# Altium project TX_custom.PrjPcb
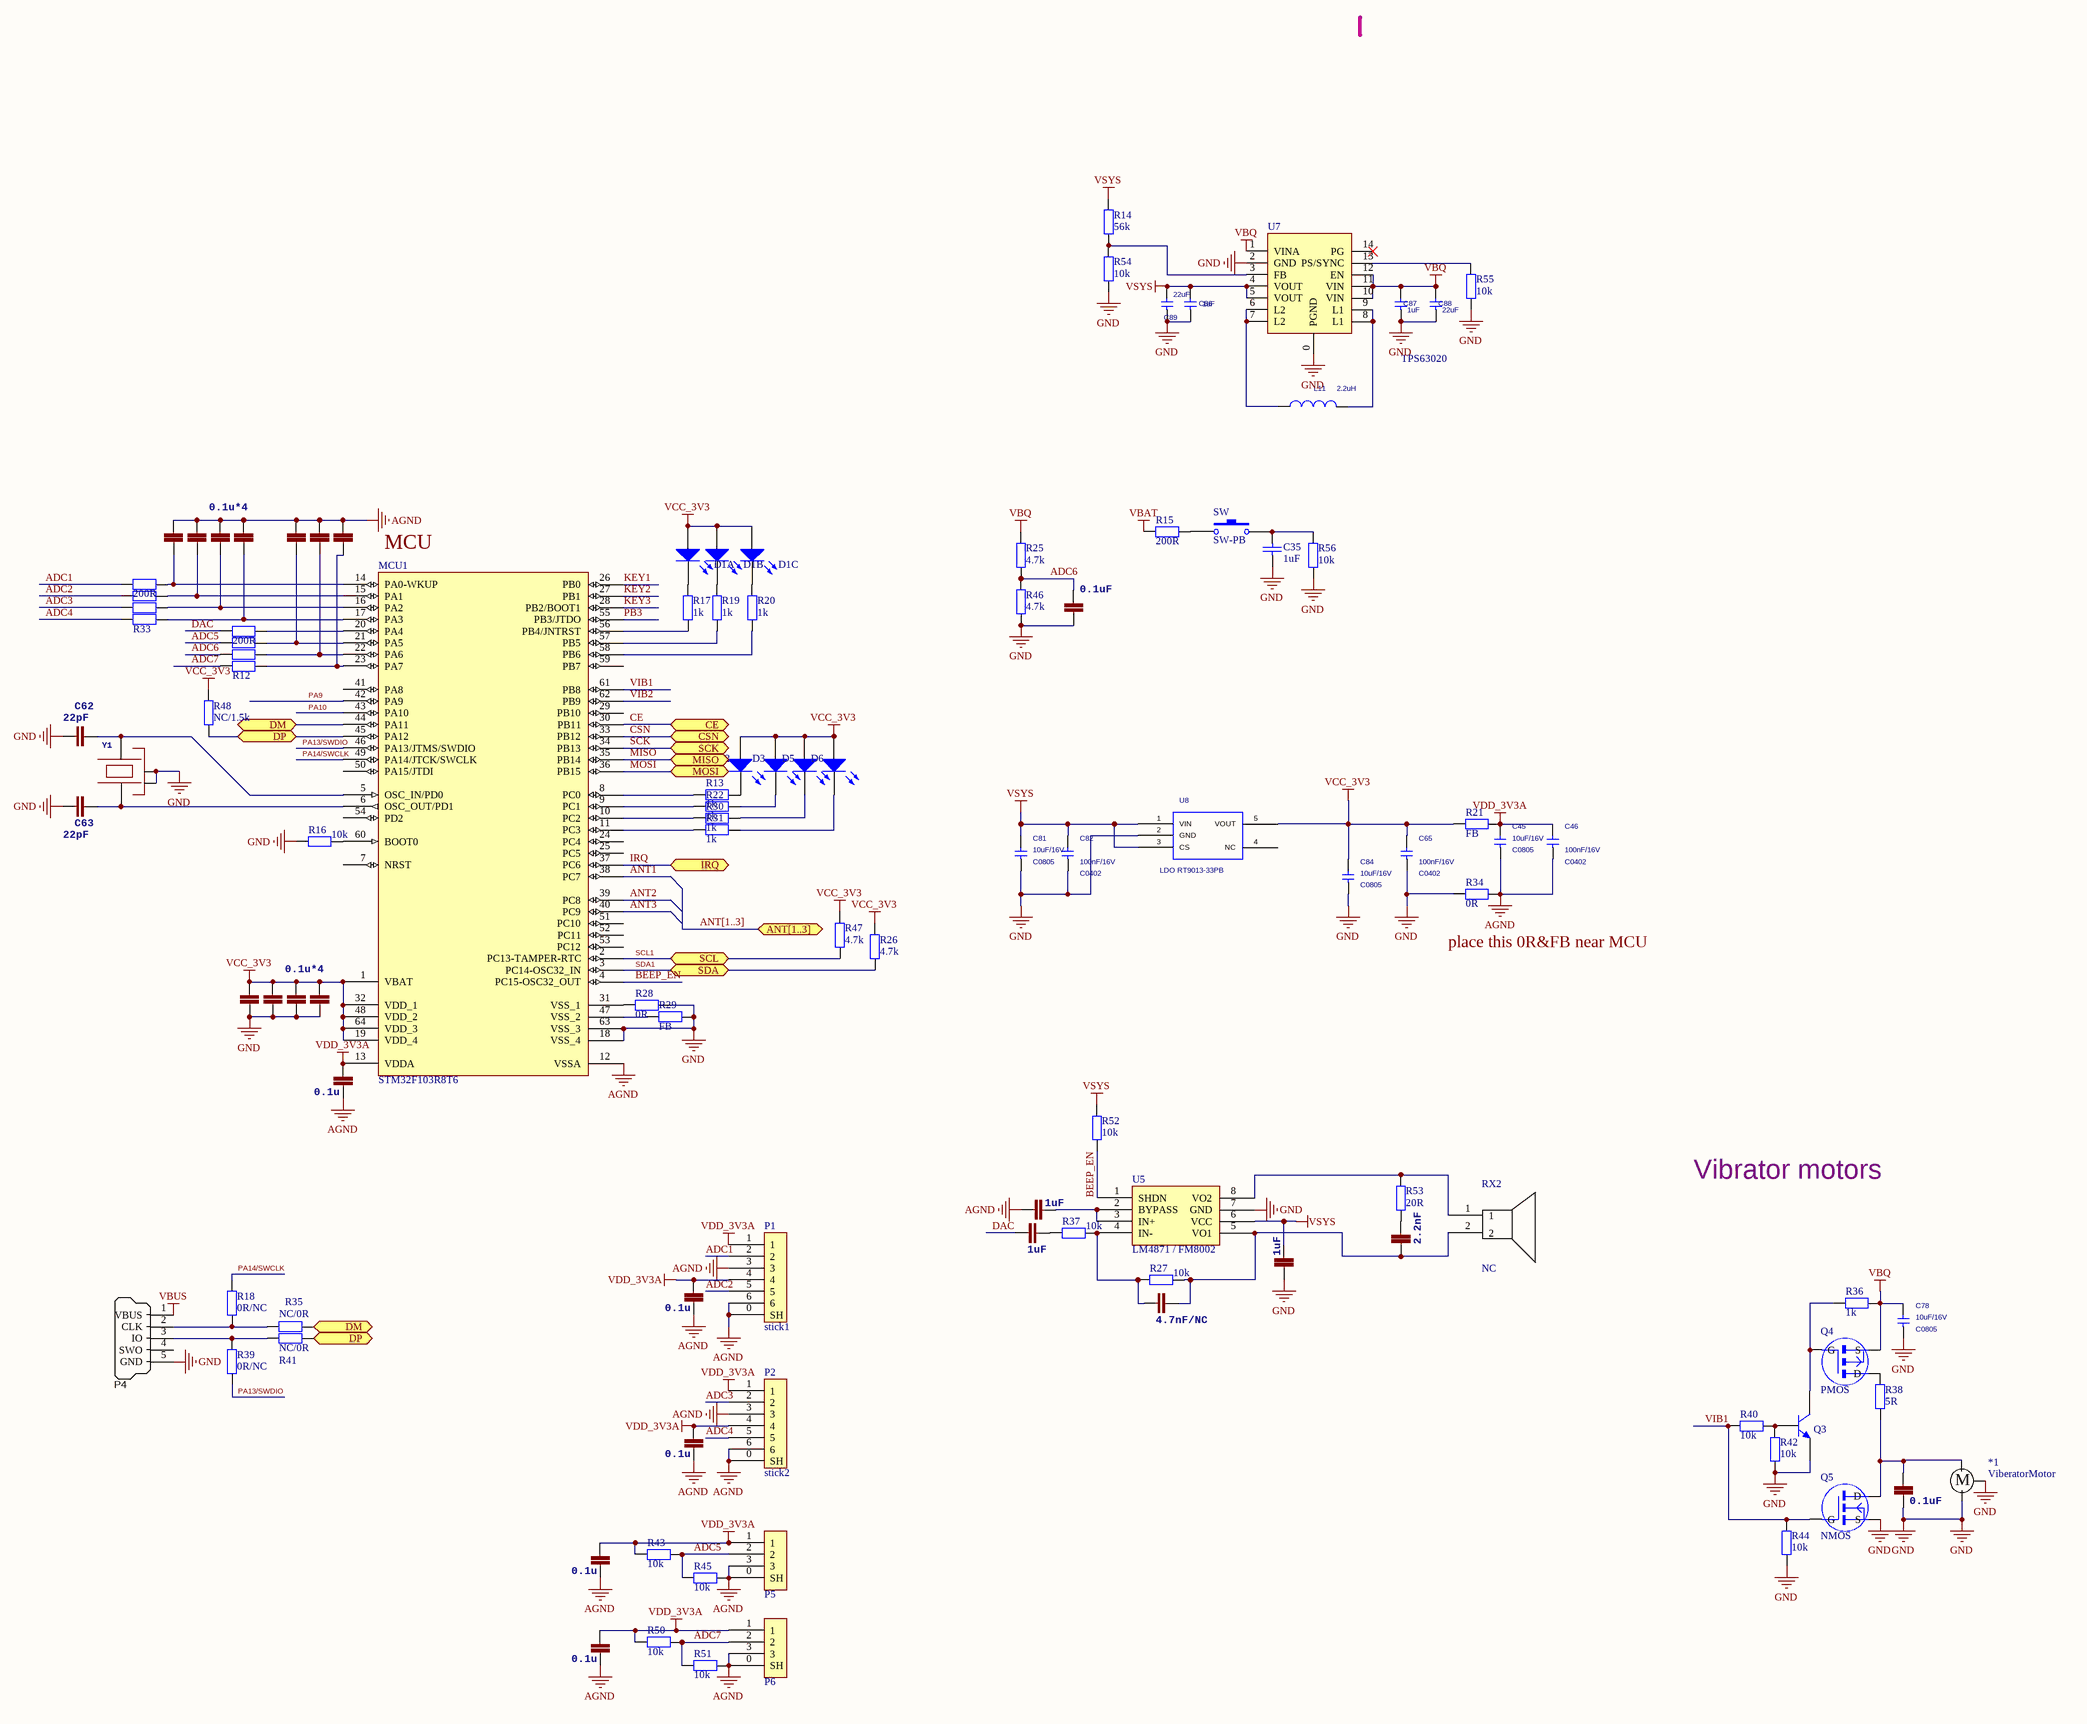
[diagram p0: TX_custom.SchDoc]
4 sheets, 202 parts. Net scope: flat (ports and power ports of the same name join across sheets).
Board file: TX_custom.PcbDoc
Sheets:
  TX_custom.SchDoc
  FEM.SchDoc
  BK5811.SchDoc
  BQ24295.SchDoc

## Sheet TX_custom.SchDoc
size A2

### Parts
*1  ViberatorMotor  [VibratorMotor]
C35  1uF  [0402]
C37  0.1uF  [0603]
C45  value 10uF/16V  PCB DECAL: C0805  [0805]  (hidden comment: C)
C46  value 100nF/16V  PCB DECAL: C0402  [0603]  (hidden comment: C)
C54  0.1u*4  [0402]
C55  1n  [0402]  (value not drawn)
C56  1n  [0402]  (value not drawn)
C57  1n  [0402]  (value not drawn)
C58  1n  [0402]  (value not drawn)
C59  1n  [0402]  (value not drawn)
C60  1n  [0402]  (value not drawn)
C61  0.1uF  [0402]
C62  22pF  [0402]
C63  22pF  [0402]
C65  value 100nF/16V  PCB DECAL: C0402  [0603]  (hidden comment: C)
C67  0.1u*4  [0402]
C68  1n  [0402]  (value not drawn)
C69  1n  [0402]  (value not drawn)
C70  1n  [0402]  (value not drawn)
C71  0.1u  [0402]
C72  1uF  [0603]
C73  1uF  [0603]
C74  2.2nF  [0402]
C75  1uF  [0603]
C76  4.7nF/NC  [0402]
C77  0.1u  [0402]
C78  value 10uF/16V  PCB DECAL: C0805  [0805]  (hidden comment: C)
C79  0.1u  [0402]
C80  0.1u  [0402]
C81  value 10uF/16V  PCB DECAL: C0805  [0805]  (hidden comment: C)
C82  value 100nF/16V  PCB DECAL: C0402  [0603]  (hidden comment: C)
C83  0.1u  [0402]
C84  value 10uF/16V  PCB DECAL: C0805  [0805]  (hidden comment: C)
C86  1uF  [0805]
C87  1uF  [0805]
C88  22uF  [0805]
C89  22uF  [0805]
D1  LEDx3  [LC-0603_Rx2]  (value not drawn)  (parts A,B,C of 3)
D2  LED0  [0603LED]  (value not drawn)
D3  LED0  [0603LED]  (value not drawn)
D5  LED0  [0603LED]  (value not drawn)
D6  LED0  [0603LED]  (value not drawn)
L11  2.2uH  [L3015]
MCU1  STM32F103R8T6  [LQFP64_N]
P1  stick1  [WFRSM125 - 6P]
P2  stick2  [WFRSM125 - 6P]
P4  SWD_MicroUSB  [MICRO-YZX]  (value not drawn)
P5  3PSocket_T  [WFRSM125 - 3P]  (value not drawn)
P6  3PSocket_T  [WFRSM125 - 3P]  (value not drawn)
Q3  NPN  [SOT-23B_L]  (value not drawn)
Q4  PMOS  [SOT-23B_L]
Q5  NMOS  [SOT-23B_L]
R12  200R  [0402X4]
R13  1k  [0402]
R14  56k  [0402]
R15  200R  [0402]
R16  10k  [0402]
R17  1k  [0402]
R18  0R/NC  [0402]
R19  1k  [0402]
R20  1k  [0402]
R21  FB  [0402]
R22  1k  [0402]
R25  4.7k  [0402]
R26  4.7k  [0402]
R27  10k  [0402]
R28  0R  [0402]
R29  FB  [0402]
R30  1k  [0402]
R31  1k  [0402]
R33  200R  [0402X4]
R34  0R  [0402]
R35  NC/0R  [0402]
R36  1k  [0402]
R37  10k  [0402]
R38  5R  [0603]
R39  0R/NC  [0402]
R40  10k  [0402]
R41  NC/0R  [0402]
R42  10k  [0402]
R43  10k  [0402]
R44  10k  [0402]
R45  10k  [0402]
R46  4.7k  [0402]
R47  4.7k  [0402]
R48  NC/1.5k  [0402]
R50  10k  [0402]
R51  10k  [0402]
R52  10k  [0402]
R53  20R  [0402]
R54  10k  [0402]
R55  10k  [0402]
R56  10k  [0402]
RX2  NC  [sonar-10mm]
SW  SW-PB  [SW3x4]
U5  LM4871 / FM8002  [SOIC8_39MM]
U7  TPS63020  [TPS63020]
U8  value LDO RT9013-33PB  [SOT23-5]  (hidden comment: RT9193-33_1_2)
Y1  16Mhz  [OSCILLATOR-3.2X2.5]  (value not drawn)

### Ports
ANT[1..3], CE, CSN, DM, DP, IRQ, MISO, MOSI, SCK, SCL, SDA

### Nets
AGND: C45.2 C46.2 C54.2 C55.2 C56.2 C57.2 C58.2 C59.2 C60.2 C71.1 C72.2 C77.1 C79.1 C80.1 C83.1 MCU1.12(VSSA) P1.0(SH) P1.3 P1.6 P2.0(SH) P2.3 P2.6 P5.0(SH) P5.3 P6.0(SH) P6.3 R34.1 R45.2 R51.2
GND: *1.0 *1.2 C35.2 C37.2 C61.1 C62.2 C63.2 C65.2 C67.1 C68.1 C69.1 C70.1 C75.2 C78.2 C81.2 C82.2 C84.2 C86.2 C87.2 C88.2 C89.2 MCU1.18(VSS_4) MCU1.63(VSS_3) P4.5(GND) Q3.2(E) Q5.S R16.1 R28.1 R29.1 R34.2 R42.1 R44.1 R46.1 R54.2 R55.2 R56.1 U5.7(GND) U7.0(PGND) U7.2(GND) U8.2(GND) Y1.2(NC_2) Y1.4(NC_4)
VBAT: R15.1
VBQ: C78.1 C87.1 C88.1 Q4.S R25.2 R36.1 U7.1(VINA) U7.10(VIN) U7.11(VIN) U7.12(EN)
VBUS: P4.1(VBUS)
VCC_3V3: C65.1 C67.2 C68.2 C69.2 C70.2 C84.1 D1.1(A) D2.1(A) D3.1(A) D5.1(A) D6.1(A) MCU1.1(VBAT) MCU1.19(VDD_4) MCU1.32(VDD_1) MCU1.48(VDD_2) MCU1.64(VDD_3) R21.2 R26.2 R47.2 R48.2 U8.5(VOUT)
VDD_3V3A: C45.1 C46.1 C71.2 C77.2 C79.2 C80.2 C83.2 MCU1.13(VDDA) P1.1 P1.4 P2.1 P2.4 P5.1 P6.1 R21.1 R43.1 R50.1
VSYS: C75.1 C81.1 C82.1 C86.1 C89.1 R14.1 R52.2 U5.6(VCC) U7.4(VOUT) U7.5(VOUT) U8.1(VIN) U8.3(CS)
ADC1: P1.2 R33.1
ADC2: P1.5 R33.2
ADC3: P2.2 R33.3
ADC4: P2.5 R33.4
ADC5: P5.2 R12.2 R43.2 R45.1
ADC6: C61.2 R12.3 R25.1 R46.2
ADC7: P6.2 R12.4 R50.2 R51.1
ANT1: MCU1.38(PC7)
ANT2: MCU1.39(PC8)
ANT3: MCU1.40(PC9)
BEEP_EN: MCU1.4(PC15-OSC32_OUT) R52.1 U5.1(SHDN)
CE: MCU1.30(PB11) ; port CE
CSN: MCU1.33(PB12) ; port CSN
DAC: C73.2 R12.1
IRQ: MCU1.37(PC6) ; port IRQ
KEY1: MCU1.26(PB0)
KEY2: MCU1.27(PB1)
KEY3: MCU1.28(PB2/BOOT1)
MISO: MCU1.35(PB14) ; port MISO
MOSI: MCU1.36(PB15) ; port MOSI
PA9: MCU1.42(PA9)
PA10: MCU1.43(PA10)
PA13/SWDIO: MCU1.46(PA13/JTMS/SWDIO) R39.2
PA14/SWCLK: MCU1.49(PA14/JTCK/SWCLK) R18.1
PB3: MCU1.55(PB3/JTDO)
SCK: MCU1.34(PB13) ; port SCK
SCL1: MCU1.2(PC13-TAMPER-RTC) R47.1 ; port SCL
SDA1: MCU1.3(PC14-OSC32_IN) R26.1 ; port SDA
VIB1: MCU1.61(PB8) Q5.G R40.2 R44.2
VIB2: MCU1.62(PB9)
Net*1_1: *1.1 C37.1 Q5.D R38.1
NetC35_1: C35.1 R56.2 SW.2
NetC54_1: C54.1 MCU1.14(PA0-WKUP) R33.8
NetC55_1: C55.1 MCU1.15(PA1) R33.7
NetC56_1: C56.1 MCU1.16(PA2) R33.6
NetC57_1: C57.1 MCU1.17(PA3) R33.5
NetC58_1: C58.1 MCU1.21(PA5) R12.7
NetC59_1: C59.1 MCU1.22(PA6) R12.6
NetC60_1: C60.1 MCU1.23(PA7) R12.5
NetC62_1: C62.1 MCU1.5(OSC_IN/PD0) Y1.3
NetC63_1: C63.1 MCU1.6(OSC_OUT/PD1) Y1.1
NetC72_1: C72.1 U5.2(BYPASS) U5.3(IN+)
NetC73_1: C73.1 R37.1
NetC74_1: C74.1 R53.1
NetC74_2: C74.2 C76.1 R27.2 RX2.2 U5.5(VO1)
NetC76_2: C76.2 R27.1 R37.2 U5.4(IN-)
NetD1_2: D1.2(K) R17.2
NetD1_3: D1.3(K) R19.2
NetD1_4: D1.4(K) R20.2
NetD2_2: D2.2(K) R13.1
NetD3_2: D3.2(K) R22.1
NetD5_2: D5.2(K) R30.1
NetD6_2: D6.2(K) R31.1
NetL11_1: L11.1 U7.8(L1) U7.9(L1)
NetL11_2: L11.2 U7.6(L2) U7.7(L2)
NetMCU1_8: MCU1.8(PC0) R13.2
NetMCU1_9: MCU1.9(PC1) R22.2
NetMCU1_10: MCU1.10(PC2) R30.2
NetMCU1_11: MCU1.11(PC3) R31.2
NetMCU1_20: MCU1.20(PA4) R12.8
NetMCU1_31: MCU1.31(VSS_1) R28.2
NetMCU1_44: MCU1.44(PA11) R35.1 ; port DM
NetMCU1_45: MCU1.45(PA12) R41.1 R48.1 ; port DP
NetMCU1_47: MCU1.47(VSS_2) R29.2
NetMCU1_56: MCU1.56(PB4/JNTRST) R17.1
NetMCU1_57: MCU1.57(PB5) R19.1
NetMCU1_58: MCU1.58(PB6) R20.1
NetMCU1_60: MCU1.60(BOOT0) R16.2
NetP4_2: P4.2(CLK) R18.2 R35.2
NetP4_3: P4.3(IO) R39.1 R41.2
NetQ3_1: Q3.1(B) R40.1 R42.2
NetQ3_3: Q3.3(C) Q4.G R36.2
NetQ4_D: Q4.D R38.2
NetR14_2: R14.2 R54.1 U7.3(FB)
NetR15_2: R15.2 SW.1
NetR53_2: R53.2 RX2.1 U5.8(VO2)
NetR55_1: R55.1 U7.13(PS/SYNC)

Not connected (* = marked no-connect by the designer): MCU1 7(NRST) 24(PC4) 25(PC5) 29(PB10) 41(PA8) 50(PA15/JTDI) 51(PC10) 52(PC11) 53(PC12) 54(PD2) 59(PB7); P4 4(SWO); U7 14(PG)*; U8 4(NC)

### Buses and harness runs
bus ANT[1..3] = port ANT[1..3]

### Notes on the sheet
- MCU
- (near R34) place this 0R&FB near MCU
- Vibrator motors
- (in symbol ViberatorMotor) M

### Library data of the parts
C35 = Cap: Capacitor; Published: 8-Jun-2000; LatestRevisionDate: 17-Jul-2002; LatestRevisionNote: Re-released for DXP Platform.; PackageReference: RAD-0.3; Publisher: Altium Limited; PackageDescription: Radial Cap, Thru-Hole; 2 Leads; 0.3 in Pin Spacing
C37 C54-C63 C67-C77 C79 C80 C83 = CAP0402-CAP: <b>Capacitor</b> / Standard 0603 ceramic capacitor, and 0.1" leaded capacitor.; PARTNO: CC0402ZRY5V7BB104
C45 C46 C65 C78 C81 C82 C84 = C: Source_Path: C:\USERS\EULER-SJ\DESKTOP\CHEN-PI2\LIBRARY1.OLB; PSpiceTemplate: C^@REFDES %1 %2 ?TOLERANCE|C^@REFDES| @VALUE ?IC/IC=@IC/ ?TOLERANCE|\n.model C^@REFDES CAP C=1 DEV=@TOLERANCE%|
C86-C89 = C: PCB DECAL: C0805; Source_Path: C:\USERS\EULER-SJ\DESKTOP\CHEN-PI2\LIBRARY1.OLB; Value: 10uF/16V; PSpiceTemplate: C^@REFDES %1 %2 ?TOLERANCE|C^@REFDES| @VALUE ?IC/IC=@IC/ ?TOLERANCE|\n.model C^@REFDES CAP C=1 DEV=@TOLERANCE%|
D1 = LEDx3: Typical RED GaAs LED; Published: 8-Jun-2000; LatestRevisionDate: 08-Jul-2005; LatestRevisionNote: Mech Layer 1 removed.; PackageReference: LED-1; Publisher: Altium Limited; PackageDescription: LED; 2 Leads
D2 D3 D5 D6 = LED0: Typical INFRARED GaAs LED; Published: 8-Jun-2000; LatestRevisionDate: 08-Jul-2005; LatestRevisionNote: Mech Layer 1 removed.; PackageReference: LED-0; Publisher: Altium Limited; PackageDescription: LED; 2 Leads
L11 = INDUCTOR: PCB DECAL: LC7066CN; Source_Path: C:\PROGRAM FILES\ORCAD\CAPTURE\LIBRARY\DISCRETE.OLB; Value: 4.7uH
MCU1 = STM32F103R8T6: STM32 ARM-based 32-bit MCU with 64 Kbytes Flash, 64-pin LQFP, Industrial Temperature; Published: *; DatasheetVersion: *; PackageVersion: *; PackageReference: *; Publisher: *; PackageDescription: *; ComponentLink1Description: *; ComponentLink1URL: *; ComponentLink2Description: *; ComponentLink2URL: *
P1 P2 = 6PSocket_T
P4 = SWD_MicroUSB: Connector SMD USB Micro Type B middle mount; Manufacturer 1: Molex Inc; SCDType: undef; Package / Case: SMD; Supplier 1: Digi-Key; Supplier Part Number 1: WM17142CT-ND
Q3 = NPN: NPN Bipolar Transistor; Published: 8-Jun-2000; LatestRevisionDate: 29-May-2009; LatestRevisionNote: IPC-7351 Footprint Added.; PackageVersion: Aug-1999; PackageReference: SOT-23B; Publisher: Altium Limited; PackageDescription: 3-Pin SOT-23 Package 0.95 mm Pitch, 2.4 mm Lead Span
Q4 = PMOS: pin to pad: D>3 G>1 S>2
Q5 = NMOS: pin to pad: D>3 G>1 S>2
R12 R33 = Res*4: Resistor; Value: 0Ohm; Published: 8-Jun-2000; LatestRevisionDate: 17-Jul-2002; LatestRevisionNote: Re-released for DXP Platform.; PackageReference: AXIAL-0.4; Publisher: Altium Limited; PackageDescription: Axial Device, Thru-Hole; 2 Leads; 0.4 in Pin Spacing
R13 R16-R20 R22 R27 R30 R31 R35 R37 R39 R41 R43 R45 R50-R53 = Res2: Resistor; Value: 0Ohm; Published: 8-Jun-2000; LatestRevisionDate: 17-Jul-2002; LatestRevisionNote: Re-released for DXP Platform.; PackageReference: AXIAL-0.4; Publisher: Altium Limited; PackageDescription: Axial Device, Thru-Hole; 2 Leads; 0.4 in Pin Spacing
R14 R15 R21 R28 R29 R34 R36 R40 R44 R54-R56 = Res2: Resistor; Published: 8-Jun-2000; LatestRevisionDate: 17-Jul-2002; LatestRevisionNote: Re-released for DXP Platform.; PackageReference: AXIAL-0.4; Publisher: Altium Limited; PackageDescription: Axial Device, Thru-Hole; 2 Leads; 0.4 in Pin Spacing
R25 R26 R38 R42 R46-R48 = Res2: Resistor; Value: 22k 1%; Published: 8-Jun-2000; LatestRevisionDate: 17-Jul-2002; LatestRevisionNote: Re-released for DXP Platform.; PackageReference: AXIAL-0.4; Publisher: Altium Limited; PackageDescription: Axial Device, Thru-Hole; 2 Leads; 0.4 in Pin Spacing
RX2 = sonar
SW = SW-PB: Switch; Published: 24-Mar-1999; LatestRevisionDate: 17-Jul-2002; LatestRevisionNote: Re-released for DXP Platform.; PackageReference: SPST-2; Publisher: Altium Limited; PackageDescription: Switch; 2 Leads
U5 = LM4871
U8 = RT9193-33_1_2: Part_No_: 1; Source_Path: W:\PROJECT\JOVI\NT96650\REFERENCE CIRCUIT\NT96650ES_PANA34110.DSN; PCB DECAL: SOT23-5
Y1 = OSCILLATOR-3.2X2.5: Crystal Oscillator in 3.2x2.5 SMD

## Sheet FEM.SchDoc
size A4
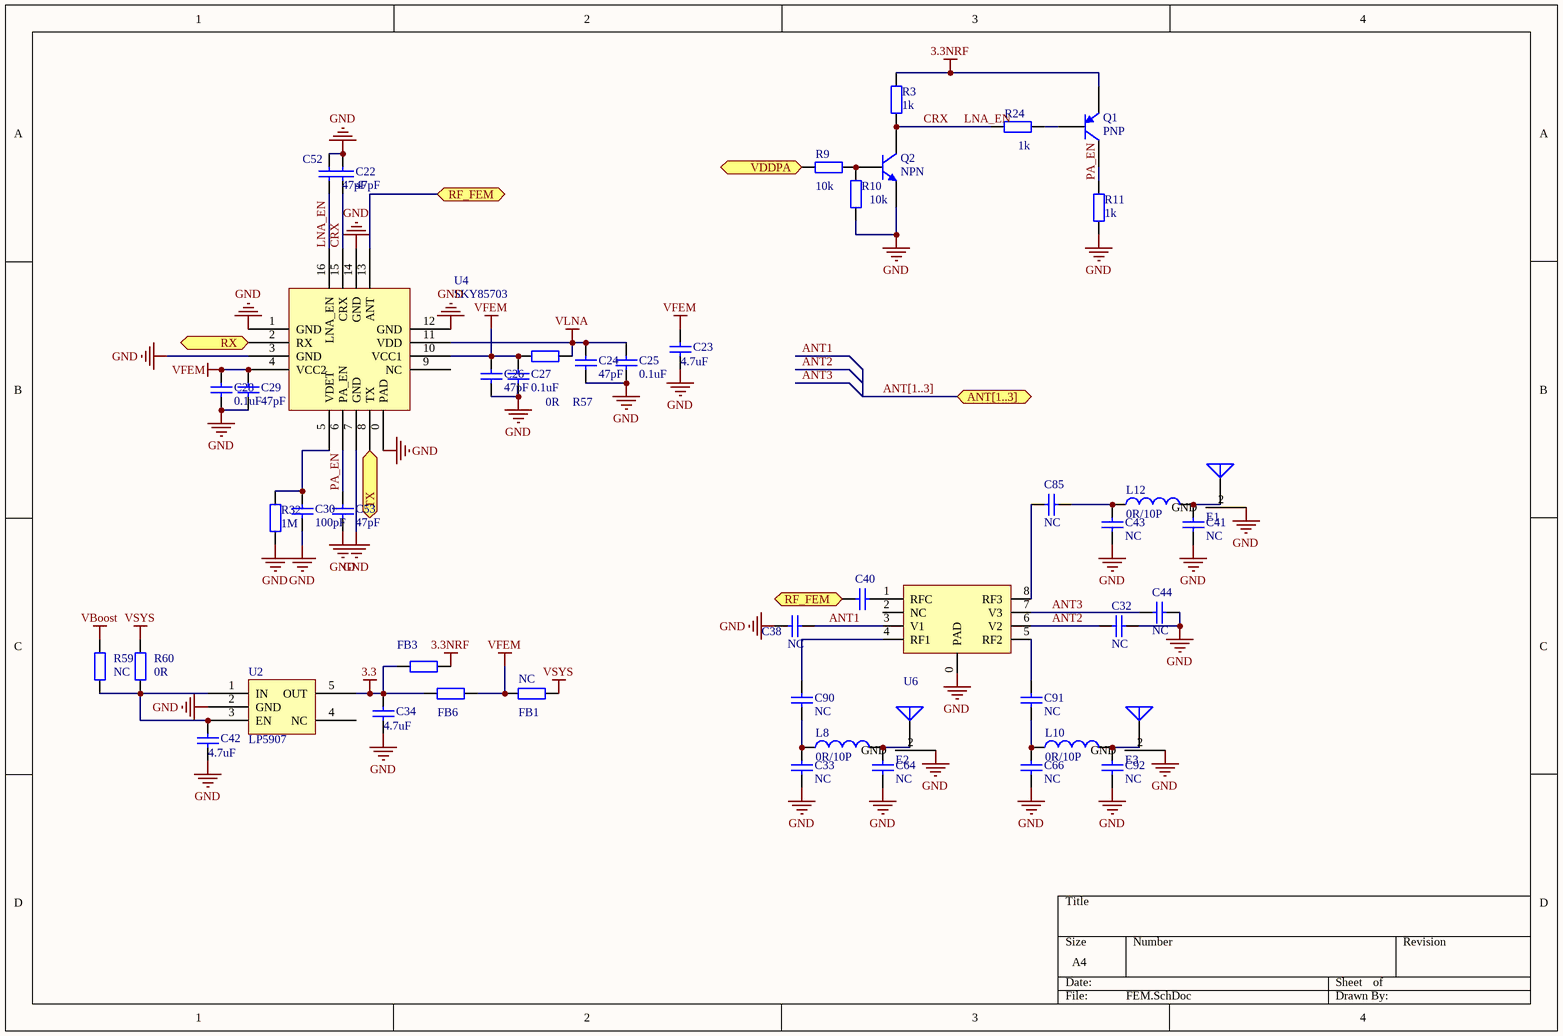
[diagram p1: FEM.SchDoc]

### Parts
C22  47pF  [0402]
C23  4.7uF  [0805]
C24  47pF  [0402]
C25  0.1uF  [0402]
C26  47pF  [0402]
C27  0.1uF  [0402]
C28  0.1uF  [0402]
C29  47pF  [0402]
C30  100pF  [0402]
C32  value NC  [0402]  (hidden comment: Cap)
C33  value NC  [0402]  (hidden comment: Cap)
C34  4.7uF  [0603]
C38  value NC  [0402]  (hidden comment: Cap)
C40  10p  [0402]  (value not drawn)
C41  value NC  [0402]  (hidden comment: Cap)
C42  4.7uF  [0603]
C43  value NC  [0402]  (hidden comment: Cap)
C44  value NC  [0402]  (hidden comment: Cap)
C52  47pF  [0402]
C53  47pF  [0402]
C64  value NC  [0402]  (hidden comment: Cap)
C66  value NC  [0402]  (hidden comment: Cap)
C85  value NC  [0402]  (hidden comment: Cap)
C90  value NC  [0402]  (hidden comment: Cap)
C91  value NC  [0402]  (hidden comment: Cap)
C92  value NC  [0402]  (hidden comment: Cap)
E1  Antenna  [IPEX]  (value not drawn)
E2  Antenna  [IPEX]  (value not drawn)
E3  Antenna  [IPEX]  (value not drawn)
FB1  NC  [0402]
FB3  Res2  [0402]  (value not drawn)
FB6  Res2  [0402]  (value not drawn)
L8  value 0R/10P  [0402]  (hidden comment: Inductor)
L10  value 0R/10P  [0402]  (hidden comment: Inductor)
L12  value 0R/10P  [0402]  (hidden comment: Inductor)
Q1  PNP  [LC-SOT-323(SC-70)]
Q2  NPN  [LC-SOT-323(SC-70)]
R3  value 1k  [0402]  (hidden comment: Res2)
R9  10k  [0402]
R10  10k  [0402]
R11  value 1k  [0402]  (hidden comment: Res2)
R24  value 1k  [0402]  (hidden comment: Res2)
R32  value 1M  [0402]  (hidden comment: Res2)
R57  0R  [0402]
R59  NC  [0402]
R60  0R  [0402]
U2  LP5907  [SOT23-5]
U4  SKY85703  [QFN16-3x3]
U6  SKY13417  [SKY13317]  (value not drawn)

### Ports
ANT[1..3], RF_FEM, RX, TX, VDDPA

### Nets
3.3: C34.2 FB3.1 FB6.1 U2.5(OUT)
3.3NRF: FB3.2 Q1.2(E) R3.1
GND: C22.1 C23.1 C24.1 C25.1 C26.1 C27.1 C28.1 C29.1 C30.1 C32.1 C33.2 C34.1 C38.1 C41.2 C42.1 C43.2 C44.1 C52.2 C53.1 C64.2 C66.2 C92.2 E1.2(GND) E2.2(GND) E3.2(GND) Q2.2(E) R10.1 R11.1 R32.2 U2.2(GND) U4.0(PAD) U4.1(GND) U4.3(GND) U4.7(GND) U4.12(GND) U4.14(GND) U6.0(PAD)
VBoost: R59.2
VFEM: C23.2 C26.2 C27.2 C28.2 C29.2 FB1.1 FB6.2 R57.1 U4.4(VCC2) U4.10(VCC1)
VLNA: C24.2 C25.2 R57.2 U4.11(VDD)
VSYS: FB1.2 R60.2
ANT1: C38.2 U6.3(V1)
ANT2: C32.2 U6.6(V2)
ANT3: C44.2 U6.7(V3)
CRX: C22.2 C52.1 Q2.3(C) R3.2 R24.1 U4.15(CRX) U4.16(LNA_EN)  [also labelled LNA_EN]
PA_EN: C53.2 Q1.3(C) R11.2 U4.6(PA_EN)
NetC7_2: U4.2(RX) ; port RX
NetC18_1: R9.1 ; port VDDPA
NetC30_2: C30.2 R32.1 U4.5(VDET)
NetC33_1: C33.1 C90.2 L8.1
NetC40_1: C40.1 U6.1(RFC)
NetC40_2: C40.2 U4.13(ANT) ; port RF_FEM
NetC41_1: C41.1 E1.1(ANT) L12.2
NetC42_2: C42.2 R59.1 R60.1 U2.1(IN) U2.3(EN)
NetC43_1: C43.1 C85.2 L12.1
NetC50_2: U4.8(TX) ; port TX
NetC64_1: C64.1 E2.1(ANT) L8.2
NetC66_1: C66.1 C91.2 L10.1
NetC85_1: C85.1 U6.8(RF3)
NetC90_1: C90.1 U6.4(RF1)
NetC91_1: C91.1 U6.5(RF2)
NetC92_1: C92.1 E3.1(ANT) L10.2
NetQ1_1: Q1.1(B) R24.2
NetQ2_1: Q2.1(B) R9.2 R10.2

Not connected (* = marked no-connect by the designer): U2 4(NC); U4 9(NC); U6 2(NC)

### Buses and harness runs
bus ANT[1..3] = port ANT[1..3]

### Library data of the parts
C22-C30 C32-C34 C38 C41-C44 C52 C53 C64 C66 C85 C90-C92 = Cap: Capacitor; Published: 8-Jun-2000; LatestRevisionDate: 17-Jul-2002; LatestRevisionNote: Re-released for DXP Platform.; PackageReference: RAD-0.3; Publisher: Altium Limited; PackageDescription: Radial Cap, Thru-Hole; 2 Leads; 0.3 in Pin Spacing
C40 = Cap: Capacitor; Value: NC; Published: 8-Jun-2000; LatestRevisionDate: 17-Jul-2002; LatestRevisionNote: Re-released for DXP Platform.; PackageReference: RAD-0.3; Publisher: Altium Limited; PackageDescription: Radial Cap, Thru-Hole; 2 Leads; 0.3 in Pin Spacing
E1-E3 = Antenna: Generic Antenna; Published: 24-Mar-1999; LatestRevisionDate: 17-Jul-2002; LatestRevisionNote: Re-released for DXP Platform.; PackageReference: PIN1; Publisher: Altium Limited
FB1 FB3 FB6 R59 R60 = Res2: Resistor; Value: FB; Published: 8-Jun-2000; LatestRevisionDate: 17-Jul-2002; LatestRevisionNote: Re-released for DXP Platform.; PackageReference: AXIAL-0.4; Publisher: Altium Limited; PackageDescription: Axial Device, Thru-Hole; 2 Leads; 0.4 in Pin Spacing
L8 L10 L12 = Inductor: Code_IEC: 1005; Published: 8-Jun-2000; LatestRevisionDate: 29-May-2009; LatestRevisionNote: IPC-7351 Footprint Added.; PackageReference: 0402-A; Publisher: Altium Limited; PackageDescription: Chip Inductor; Code_JEITA: 0402
Q1 = PNP: PNP Bipolar Transistor; Published: 8-Jun-2000; LatestRevisionDate: 29-May-2009; LatestRevisionNote: IPC-7351 Footprint Added.; PackageVersion: Aug-1999; PackageReference: SOT-23B; Publisher: Altium Limited; PackageDescription: 3-Pin SOT-23 Package 0.95 mm Pitch, 2.4 mm Lead Span
Q2 = NPN: NPN Bipolar Transistor; Published: 8-Jun-2000; LatestRevisionDate: 17-Jul-2002; LatestRevisionNote: Re-released for DXP Platform.; PackageReference: TO-226-AA; Publisher: Altium Limited; PackageDescription: TO, Flat Index; 3 In-Line, Axial Leads; Body Dia. 4.8mm; Leads 0.55 x 0.51 mm (max); Code_JEDEC: TO-226-AA
R3 R9-R11 R24 R32 R57 = Res2: Resistor; Published: 8-Jun-2000; LatestRevisionDate: 17-Jul-2002; LatestRevisionNote: Re-released for DXP Platform.; PackageReference: AXIAL-0.4; Publisher: Altium Limited; PackageDescription: Axial Device, Thru-Hole; 2 Leads; 0.4 in Pin Spacing

## Sheet BK5811.SchDoc
size A4
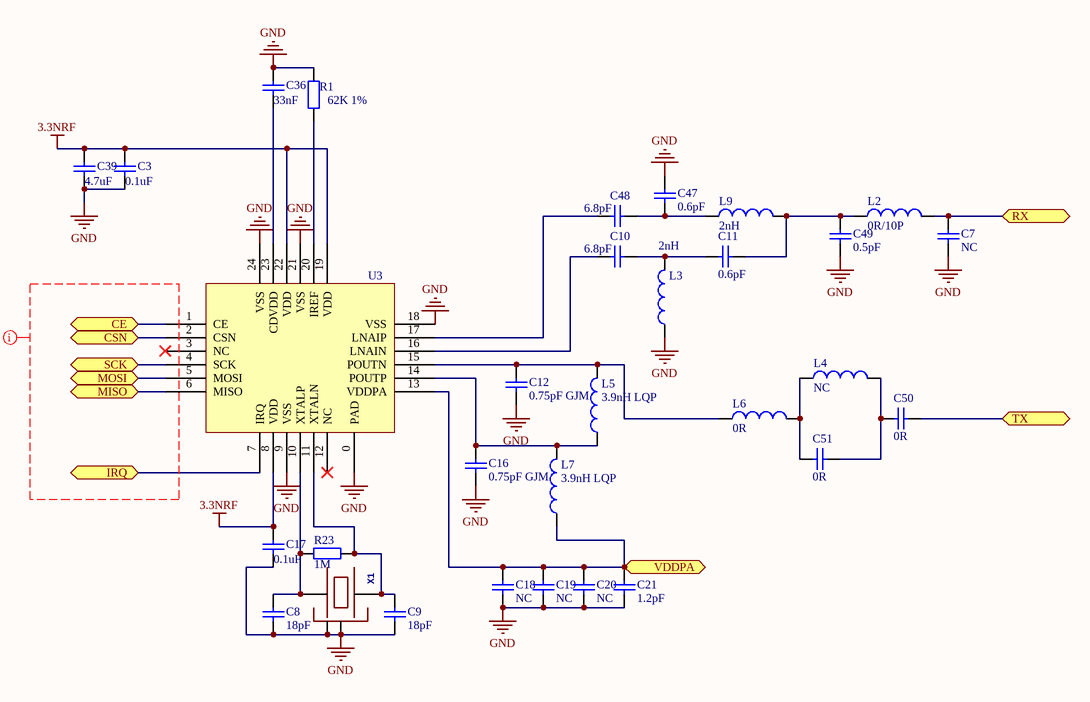
[diagram p2: BK5811.SchDoc]

### Parts
C3  0.1uF  [0402]
C7  NC  [0402]
C8  value 18pF  [0402]  (hidden comment: Cap)
C9  value 18pF  [0402]  (hidden comment: Cap)
C10  6.8pF  [0402]
C11  0.6pF  [0402]
C12  0.75pF GJM  [0402]
C16  0.75pF GJM  [0402]
C17  0.1uF  [0402]
C18  NC  [0402]
C19  NC  [0402]
C20  NC  [0402]
C21  1.2pF  [0402]
C36  33nF  [0402]
C39  4.7uF  [0603]
C47  0.6pF  [0402]
C48  6.8pF  [0402]
C49  0.5pF  [0402]
C50  0R  [0402]
C51  0R  [0402]
L2  0R/10P  [0402]
L3  2nH  [0402]
L4  NC  [0402]
L5  3.9nH LQP  [0402]
L6  0R  [0402]
L7  3.9nH LQP  [0402]
L9  2nH  [0402]
R1  62K 1%  [0402]
R23  value 1M  [0402]  (hidden comment: Res2)
U3  BK5811  [BK5811]  (value not drawn)
X1  16Mhz  [OSCILLATOR-3.2X2.5]  (value not drawn)

### Ports
CE, CSN, IRQ, MISO, MOSI, RX, SCK, TX, VDDPA

### Nets
3.3NRF: C3.2 C17.2 C39.2 U3.8(VDD) U3.19(VDD) U3.22(VDD)
GND: C3.1 C7.1 C8.2 C9.2 C12.1 C16.1 C17.1 C18.2 C19.2 C20.2 C21.2 C36.2 C39.1 C47.2 C49.1 L3.1 R1.2 U3.0(PAD) U3.9(VSS) U3.18(VSS) U3.21(VSS) U3.24(VSS) X1.2(NC_2) X1.4(NC_4)
CE: U3.1(CE) ; port CE
CSN: U3.2(CSN) ; port CSN
IRQ: U3.7(IRQ) ; port IRQ
MISO: U3.6(MISO) ; port MISO
MOSI: U3.5(MOSI) ; port MOSI
SCK: U3.4(SCK) ; port SCK
NetC7_2: C7.2 L2.2 ; port RX
NetC8_1: C8.1 R23.2 U3.10(XTALP) X1.1
NetC9_1: C9.1 R23.1 U3.11(XTALN) X1.3
NetC10_1: C10.1 U3.16(LNAIN)
NetC10_2: C10.2 C11.2 L3.2
NetC11_1: C11.1 C49.2 L2.1 L9.2
NetC12_2: C12.2 L5.2 L6.1 U3.15(POUTN)
NetC16_2: C16.2 L5.1 L7.2 U3.14(POUTP)
NetC18_1: C18.1 C19.1 C20.1 C21.1 L7.1 U3.13(VDDPA) ; port VDDPA
NetC36_1: C36.1 U3.23(CDVDD)
NetC47_1: C47.1 C48.2 L9.1
NetC48_1: C48.1 U3.17(LNAIP)
NetC50_1: C50.1 C51.2 L4.2
NetC50_2: C50.2 ; port TX
NetC51_1: C51.1 L4.1 L6.2
NetR1_1: R1.1 U3.20(IREF)

Not connected (* = marked no-connect by the designer): U3 3(NC)* 12(NC)*

### Layout directives
net class BK5811_SPI: (no net found under the mark)

### Library data of the parts
C3 C7-C12 C16-C21 C36 C39 C47-C51 = Cap: Capacitor; Published: 8-Jun-2000; LatestRevisionDate: 17-Jul-2002; LatestRevisionNote: Re-released for DXP Platform.; PackageReference: RAD-0.3; Publisher: Altium Limited; PackageDescription: Radial Cap, Thru-Hole; 2 Leads; 0.3 in Pin Spacing
L2-L7 L9 = Inductor: Code_IEC: 1005; Published: 8-Jun-2000; LatestRevisionDate: 29-May-2009; LatestRevisionNote: IPC-7351 Footprint Added.; PackageReference: 0402-A; Publisher: Altium Limited; PackageDescription: Chip Inductor; Code_JEITA: 0402
R1 R23 = Res2: Resistor; Published: 8-Jun-2000; LatestRevisionDate: 17-Jul-2002; LatestRevisionNote: Re-released for DXP Platform.; PackageReference: AXIAL-0.4; Publisher: Altium Limited; PackageDescription: Axial Device, Thru-Hole; 2 Leads; 0.4 in Pin Spacing
X1 = OSCILLATOR-3.2X2.5: Crystal Oscillator in 3.2x2.5 SMD

## Sheet BQ24295.SchDoc
size A4
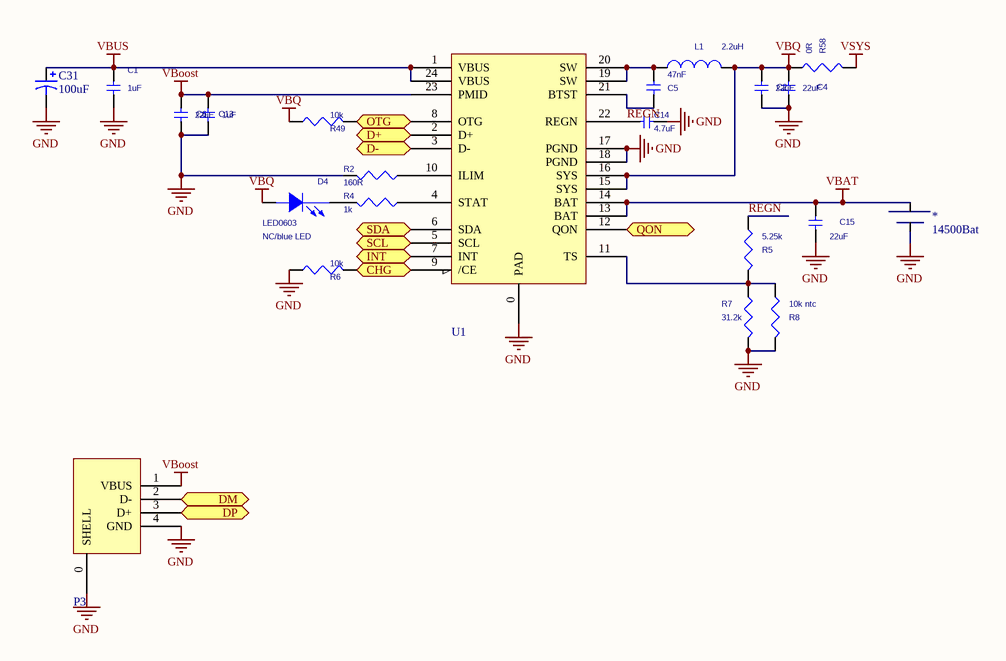
[diagram p3: BQ24295.SchDoc]

### Parts
*  14500Bat  [14500]
C1  1uF  [0805]
C2  22uF  [0805]
C4  22uF  [0805]
C5  47nF  [0402]
C6  22uF  [0805]
C13  1uF  [0603]
C14  4.7uF  [0603]
C15  22uF  [0805]
C31  100uF  [1210]
D4  value NC/blue LED  [LED0603]  (hidden comment: LED)
L1  2.2uH  [L50xx]
P3  USB_TYPE_A_SOCKET  [USB_TYPE_A_SOCKET]  (value not drawn)
R2  160R  [0402]
R4  1k  [0402]
R5  5.25k  [0402]
R6  10k  [0402]
R7  31.2k  [0402]
R8  10k ntc  [0603]
R49  10k  [0402]
R58  0R  [0402]
U1  BQ24295  [BQ24295]  (value not drawn)

### Ports
CHG, D+, D-, DM, DP, INT, OTG, QON, SCL, SDA

### Nets
GND: *.2 C1.2 C2.2 C4.2 C6.2 C13.2 C14.2 C15.2 C31.2 P3.0(SHELL) P3.4(GND) R2.2 R6.1 R7.2 R8.2 U1.0(PAD) U1.17(PGND) U1.18(PGND)
VBAT: *.1 C15.1 U1.13(BAT) U1.14(BAT)
VBoost: C6.1 C13.1 P3.1(VBUS) U1.23(PMID)
VBQ: C2.1 C4.1 D4.1(ANODE) L1.1 R49.1 R58.1 U1.15(SYS) U1.16(SYS)
VBUS: C1.1 C31.1 U1.1(VBUS) U1.24(VBUS)
VSYS: R58.2
REGN: C14.1 R5.1 U1.22(REGN)
SCL1: U1.5(SCL) ; port SCL
SDA1: U1.6(SDA) ; port SDA
NetC5_1: C5.1 U1.21(BTST)
NetC5_2: C5.2 L1.2 U1.19(SW) U1.20(SW)
NetD4_2: D4.2(CATHODE) R4.2
NetMCU1_44: P3.2(D-) ; port DM
NetMCU1_45: P3.3(D+) ; port DP
NetR2_1: R2.1 U1.10(ILIM)
NetR4_1: R4.1 U1.4(STAT)
NetR5_2: R5.2 R7.1 R8.1 U1.11(TS)
NetR6_2: R6.2 U1.9(/CE) ; port CHG
NetR49_2: R49.2 U1.8(OTG) ; port OTG
NetU1_2: U1.2(D+) ; port D+
NetU1_3: U1.3(D-) ; port D-
NetU1_7: U1.7(INT) ; port INT
NetU1_12: U1.12(QON) ; port QON

### Library data of the parts
C1 C5 C14 = C: PCB DECAL: C0402; Source_Path: C:\USERS\EULER-SJ\DESKTOP\CHEN-PI2\LIBRARY1.OLB; Value: 100nF/16V; PSpiceTemplate: C^@REFDES %1 %2 ?TOLERANCE|C^@REFDES| @VALUE ?IC/IC=@IC/ ?TOLERANCE|\n.model C^@REFDES CAP C=1 DEV=@TOLERANCE%|
C2 C4 C6 C13 C15 = C: as C86 on sheet TX_custom
C31 = Cap Pol1: Polarized Capacitor (Radial); Published: 8-Jun-2000; LatestRevisionDate: 17-Jul-2002; LatestRevisionNote: Re-released for DXP Platform.; PackageReference: RB7.6-15; Publisher: Altium Limited; PackageDescription: Polarized Capacitor (Radial); 2 Leads
D4 = LED: Source_Path: C:\PROGRAM FILES\ORCAD\CAPTURE\LIBRARY\DISCRETE.OLB; PCB DECAL: LED0603
L1 = INDUCTOR: as L11 on sheet TX_custom
R2 R4-R8 R49 R58 = R: PCB DECAL: R0402; Source_Path: C:\USERS\EULER-SJ\DESKTOP\CHEN-PI2\LIBRARY1.OLB; Value: 12K

## Nets that join several sheets
3.3NRF: FEM (FB3.2 Q1.2 R3.1), BK5811 (6 pins)
GND: TX_custom (42 pins), FEM (37 pins), BK5811 (24 pins), BQ24295 (18 pins)
VBAT: TX_custom (R15.1), BQ24295 (*.1 C15.1 U1.13 U1.14)
VBoost: FEM (R59.2), BQ24295 (C6.1 C13.1 P3.1 U1.23)
VBQ: TX_custom (10 pins), BQ24295 (8 pins)
VBUS: TX_custom (P4.1), BQ24295 (C1.1 C31.1 U1.1 U1.24)
VSYS: TX_custom (12 pins), FEM (FB1.2 R60.2), BQ24295 (R58.2)
ANT1: TX_custom (MCU1.38), FEM (C38.2 U6.3)
ANT2: TX_custom (MCU1.39), FEM (C32.2 U6.6)
ANT3: TX_custom (MCU1.40), FEM (C44.2 U6.7)
CE: TX_custom (MCU1.30), BK5811 (U3.1)
CSN: TX_custom (MCU1.33), BK5811 (U3.2)
IRQ: TX_custom (MCU1.37), BK5811 (U3.7)
MISO: TX_custom (MCU1.35), BK5811 (U3.6)
MOSI: TX_custom (MCU1.36), BK5811 (U3.5)
NetC7_2: FEM (U4.2), BK5811 (C7.2 L2.2)
NetC18_1: FEM (R9.1), BK5811 (6 pins)
NetC50_2: FEM (U4.8), BK5811 (C50.2)
NetMCU1_44: TX_custom (MCU1.44 R35.1), BQ24295 (P3.2)
NetMCU1_45: TX_custom (MCU1.45 R41.1 R48.1), BQ24295 (P3.3)
SCK: TX_custom (MCU1.34), BK5811 (U3.4)
SCL1: TX_custom (MCU1.2 R47.1), BQ24295 (U1.5)
SDA1: TX_custom (MCU1.3 R26.1), BQ24295 (U1.6)